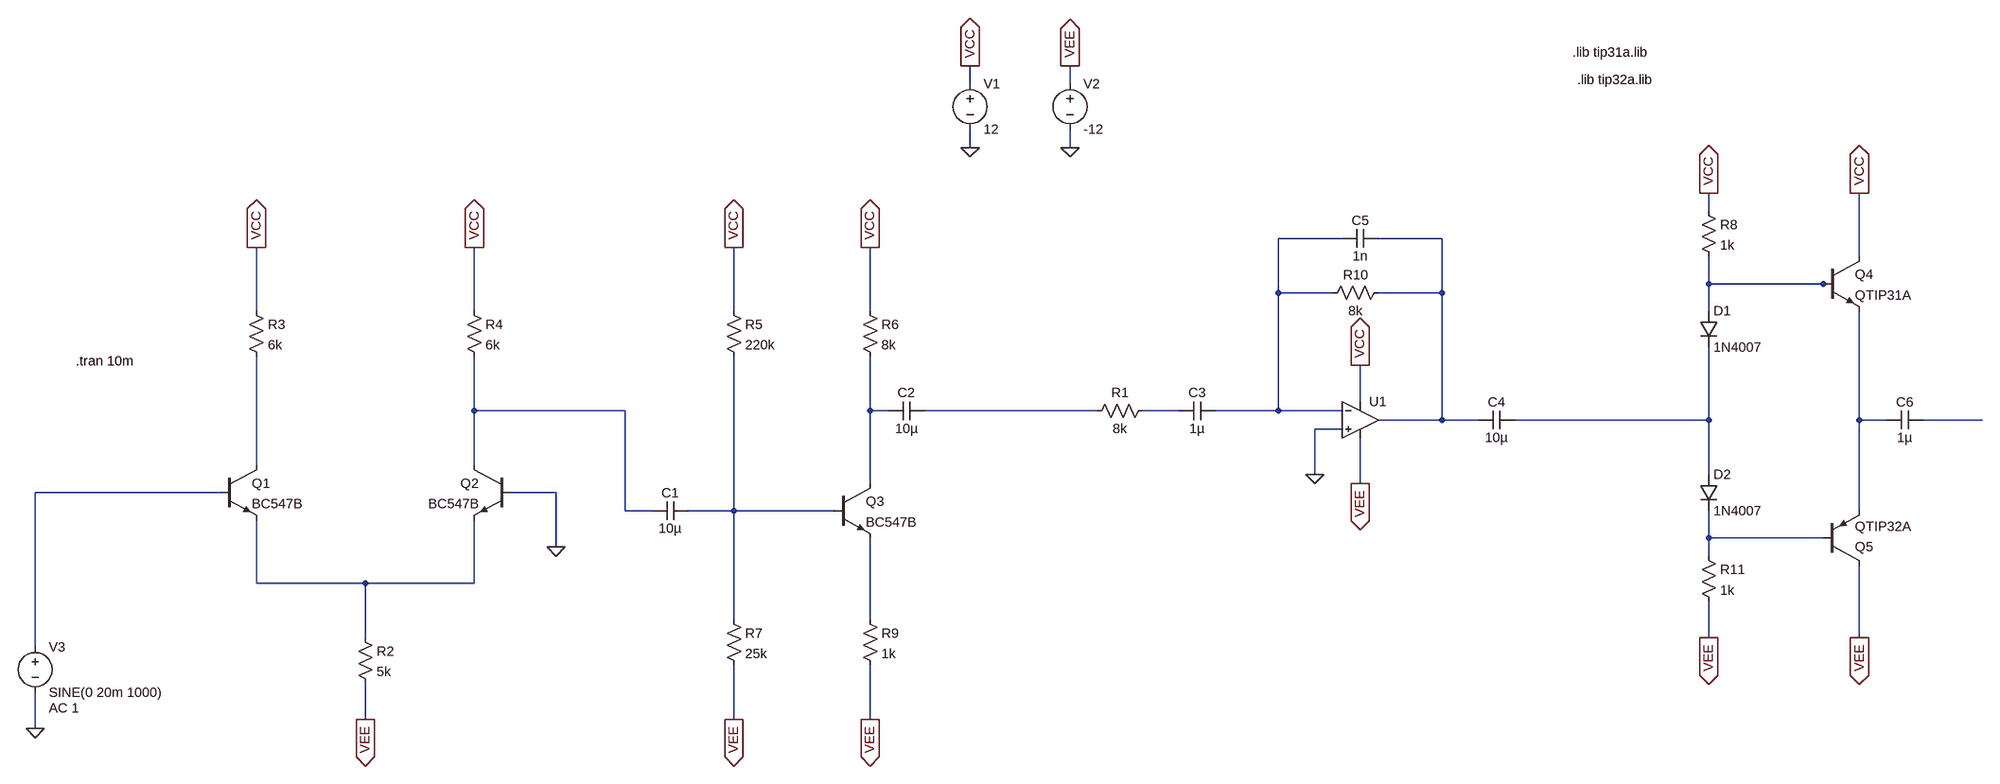
[diagram p0: schematic Ultimate Design.asc]
Ultimate Design.asc, the LTspice schematic file:
Version 4
SHEET 1 3908 1032
WIRE 1984 -192 1984 -224
WIRE 2160 -192 2160 -224
WIRE 1984 -80 1984 -112
WIRE 2160 -80 2160 -112
WIRE 3312 32 3312 0
WIRE 2656 80 2544 80
WIRE 2832 80 2720 80
WIRE 3584 112 3584 0
WIRE 3312 160 3312 112
WIRE 3520 160 3312 160
WIRE 3536 160 3520 160
WIRE 2544 176 2544 80
WIRE 2640 176 2544 176
WIRE 2832 176 2832 80
WIRE 2832 176 2720 176
WIRE 720 208 720 96
WIRE 1104 208 1104 96
WIRE 1568 208 1568 96
WIRE 1808 208 1808 96
WIRE 3312 208 3312 160
WIRE 2688 368 2688 304
WIRE 1104 384 1104 288
WIRE 1376 384 1104 384
WIRE 1808 384 1808 288
WIRE 1840 384 1808 384
WIRE 2208 384 1904 384
WIRE 2352 384 2288 384
WIRE 2544 384 2544 176
WIRE 2544 384 2416 384
WIRE 2656 384 2544 384
WIRE 2832 400 2832 176
WIRE 2832 400 2720 400
WIRE 2896 400 2832 400
WIRE 3312 400 3312 272
WIRE 3312 400 2960 400
WIRE 3584 400 3584 208
WIRE 3632 400 3584 400
WIRE 3872 400 3696 400
WIRE 2656 416 2608 416
WIRE 720 480 720 288
WIRE 1104 480 1104 384
WIRE 2608 496 2608 416
WIRE 3312 496 3312 400
WIRE 1808 512 1808 384
WIRE 2688 512 2688 432
WIRE 656 528 272 528
WIRE 1248 528 1168 528
WIRE 1376 560 1376 384
WIRE 1424 560 1376 560
WIRE 1568 560 1568 288
WIRE 1568 560 1488 560
WIRE 1744 560 1568 560
WIRE 3584 560 3584 400
WIRE 3312 608 3312 560
WIRE 3520 608 3312 608
WIRE 1248 624 1248 528
WIRE 3312 640 3312 608
WIRE 720 688 720 576
WIRE 912 688 720 688
WIRE 1104 688 1104 576
WIRE 1104 688 912 688
WIRE 1568 752 1568 560
WIRE 1808 752 1808 608
WIRE 912 784 912 688
WIRE 3312 784 3312 720
WIRE 3584 784 3584 656
WIRE 272 800 272 528
WIRE 912 928 912 864
WIRE 1568 928 1568 832
WIRE 1808 928 1808 832
WIRE 272 944 272 880
FLAG 1984 -80 0
FLAG 2160 -80 0
FLAG 272 944 0
FLAG 720 96 VCC
IOPIN 720 96 Out
FLAG 1104 96 VCC
IOPIN 1104 96 Out
FLAG 912 928 VEE
IOPIN 912 928 Out
FLAG 1984 -224 VCC
IOPIN 1984 -224 Out
FLAG 2160 -224 VEE
IOPIN 2160 -224 Out
FLAG 1568 96 VCC
IOPIN 1568 96 Out
FLAG 1808 96 VCC
IOPIN 1808 96 Out
FLAG 1568 928 VEE
IOPIN 1568 928 Out
FLAG 1808 928 VEE
IOPIN 1808 928 Out
FLAG 1248 624 0
FLAG 2608 496 0
FLAG 2688 512 VEE
IOPIN 2688 512 Out
FLAG 2688 304 VCC
IOPIN 2688 304 Out
FLAG 3312 0 VCC
IOPIN 3312 0 Out
FLAG 3312 784 VEE
IOPIN 3312 784 Out
FLAG 3584 0 VCC
IOPIN 3584 0 Out
FLAG 3584 784 VEE
IOPIN 3584 784 Out
SYMBOL voltage 1984 -208 R0
WINDOW 123 0 0 Left 0
WINDOW 39 0 0 Left 0
SYMATTR InstName V1
SYMATTR Value 12
SYMBOL voltage 2160 -208 R0
WINDOW 123 0 0 Left 0
WINDOW 39 0 0 Left 0
SYMATTR InstName V2
SYMATTR Value -12
SYMBOL npn 656 480 R0
SYMATTR InstName Q1
SYMATTR Value BC547B
SYMBOL voltage 272 784 R0
WINDOW 123 24 124 Left 2
WINDOW 39 0 0 Left 0
SYMATTR Value2 AC 1
SYMATTR InstName V3
SYMATTR Value SINE(0 20m 1000)
SYMBOL npn 1168 480 M0
SYMATTR InstName Q2
SYMATTR Value BC547B
SYMBOL res 704 192 R0
SYMATTR InstName R3
SYMATTR Value 6k
SYMBOL res 1088 192 R0
SYMATTR InstName R4
SYMATTR Value 6k
SYMBOL cap 1488 544 R90
WINDOW 0 0 32 VBottom 2
WINDOW 3 32 32 VTop 2
SYMATTR InstName C1
SYMATTR Value 10µ
SYMBOL res 1552 192 R0
SYMATTR InstName R5
SYMATTR Value 220k
SYMBOL res 1792 192 R0
SYMATTR InstName R6
SYMATTR Value 8k
SYMBOL res 1552 736 R0
SYMATTR InstName R7
SYMATTR Value 25k
SYMBOL npn 1744 512 R0
SYMATTR InstName Q3
SYMATTR Value BC547B
SYMBOL cap 1904 368 R90
WINDOW 0 0 32 VBottom 2
WINDOW 3 32 32 VTop 2
SYMATTR InstName C2
SYMATTR Value 10µ
SYMBOL res 1792 736 R0
SYMATTR InstName R9
SYMATTR Value 1k
SYMBOL res 896 768 R0
SYMATTR InstName R2
SYMATTR Value 5k
SYMBOL res 2304 368 R90
WINDOW 0 0 56 VBottom 2
WINDOW 3 32 56 VTop 2
SYMATTR InstName R1
SYMATTR Value 8k
SYMBOL cap 2416 368 R90
WINDOW 0 0 32 VBottom 2
WINDOW 3 32 32 VTop 2
SYMATTR InstName C3
SYMATTR Value 1µ
SYMBOL OpAmps\\UniversalOpAmp 2688 400 R0
SYMATTR InstName U1
SYMBOL cap 2960 384 R90
WINDOW 0 0 32 VBottom 2
WINDOW 3 32 32 VTop 2
SYMATTR InstName C4
SYMATTR Value 10µ
SYMBOL cap 2720 64 R90
WINDOW 0 0 32 VBottom 2
WINDOW 3 32 32 VTop 2
SYMATTR InstName C5
SYMATTR Value 1n
SYMBOL res 2736 160 R90
WINDOW 0 0 56 VBottom 2
WINDOW 3 32 56 VTop 2
SYMATTR InstName R10
SYMATTR Value 8k
SYMBOL diode 3296 208 R0
SYMATTR InstName D1
SYMATTR Value 1N4007
SYMBOL res 3296 16 R0
SYMATTR InstName R8
SYMATTR Value 1k
SYMBOL diode 3296 496 R0
SYMATTR InstName D2
SYMATTR Value 1N4007
SYMBOL res 3296 624 R0
SYMATTR InstName R11
SYMATTR Value 1k
SYMBOL npn 3520 112 R0
SYMATTR InstName Q4
SYMATTR Value QTIP31A
SYMBOL pnp 3520 656 M180
SYMATTR InstName Q5
SYMATTR Value QTIP32A
SYMBOL cap 3696 384 R90
WINDOW 0 0 32 VBottom 2
WINDOW 3 32 32 VTop 2
SYMATTR InstName C6
SYMATTR Value 1µ
TEXT 344 296 Left 2 !.tran 10m
TEXT 3072 -248 Left 2 !.lib tip31a.lib
TEXT 3080 -200 Left 2 !.lib tip32a.lib

The netlist it stands for:
* Ultimate Design.asc
V1 VCC 0 12
V2 VEE 0 -12
Q1 N011 N012 N015 0 BC547B
V3 N012 0 SINE(0 20m 1000) AC 1
Q2 N004 0 N015 0 BC547B
R3 VCC N011 6k
R4 VCC N004 6k
C1 N013 N004 10µ
R5 VCC N013 220k
R6 VCC N005 8k
R7 N013 VEE 25k
Q3 N005 N013 N016 0 BC547B
C2 N006 N005 10µ
R9 N016 VEE 1k
R2 N015 VEE 5k
R1 N007 N006 8k
C3 N001 N007 1µ
XU1 0 N001 VCC VEE N002 level1 Avol=1Meg GBW=10Meg Vos=0 En=0 Enk=0 In=0 Ink=0 Rin=500Meg  ; pins In+ In- V+ V- OUT
C4 N008 N002 10µ
C5 N002 N001 1n
R10 N002 N001 8k
D1 N003 N008 1N4007
R8 VCC N003 1k
D2 N008 N014 1N4007
R11 N014 VEE 1k
Q4 VCC N003 N009 0 QTIP31A
Q5 VEE N014 N009 0 QTIP32A
C6 N010 N009 1µ
.model D D
.lib standard.dio
.model NPN NPN
.model PNP PNP
.lib standard.bjt
.tran 10m
.lib tip31a.lib
.lib tip32a.lib
.lib UniversalOpAmp1.lib
.backanno
.end